# EAGLE design eagle_whitestar-adapter-ta (EAGLE 7.3.0)
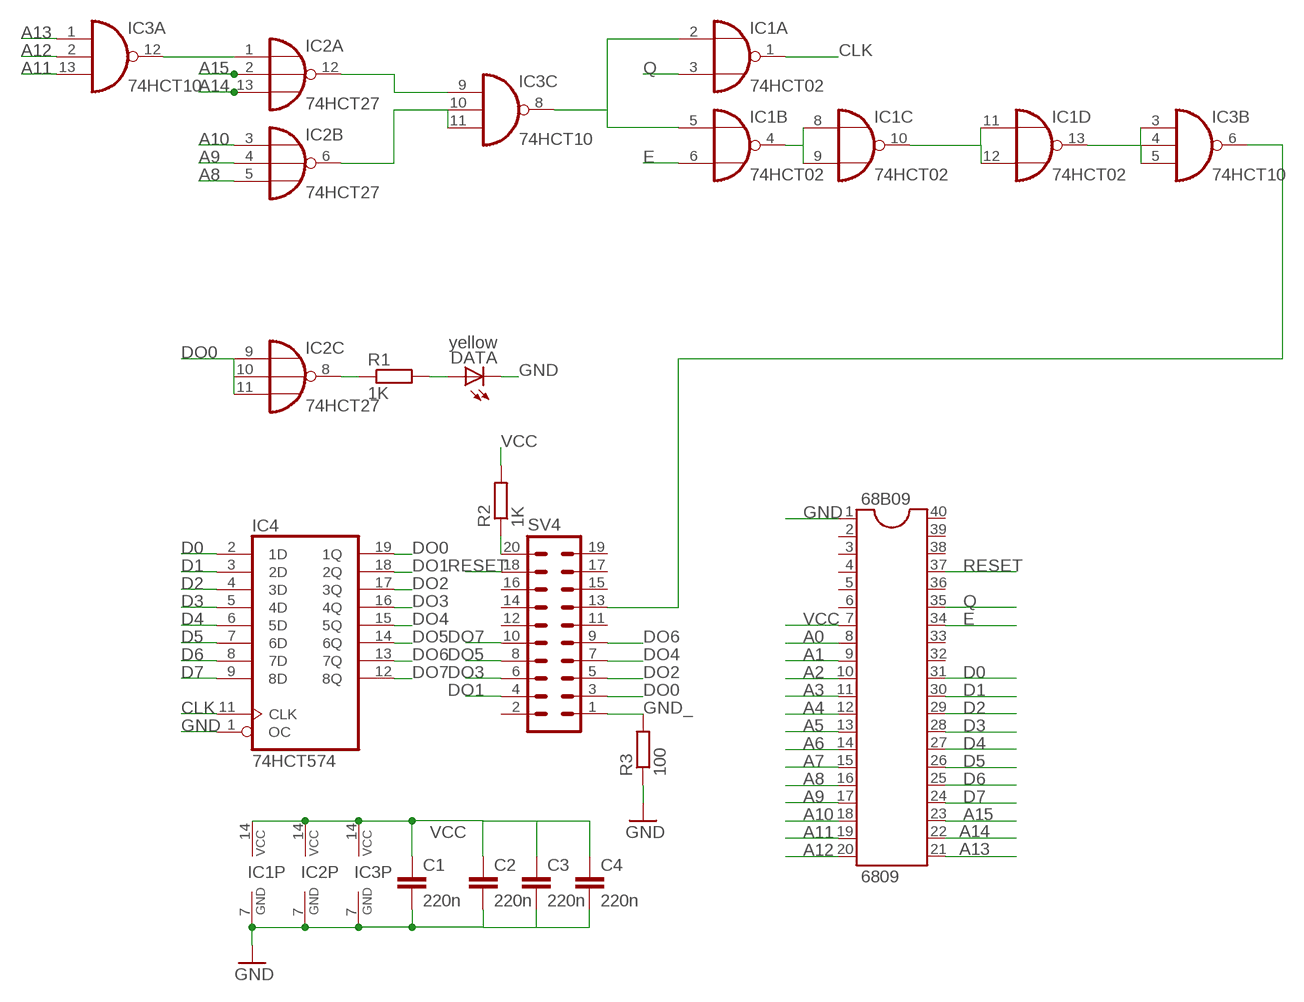
[diagram p0: schematic, sheet 1]

## Parts
68B09  6809  DIL40  [DIL40]
C1  220n  C-EUC0603K  [C0603K]
C2  220n  C-EUC0603K  [C0603K]
C3  220n  C-EUC0603K  [C0603K]
C4  220n  C-EUC0603K  [C0603K]
DATA  yellow  LEDSML0603  [SML0603]
IC1  74HCT02  74HCT02D  [SO14]
IC2  74HCT27  74HCT27D  [SO14]
IC3  74HCT10  74AC10D  [SO14]
IC4  74HCT574  74HCT574D  [SO20W]
R1  1K  R-EU_R0603  [R0603]
R2  1K  R-EU_R0603  [R0603]
R3  100  R-EU_R0603  [R0603]
SV4  MA10-2  [MA10-2]

## Nets
A0: 68B09.8
A1: 68B09.9
A2: 68B09.10
A3: 68B09.11
A4: 68B09.12
A5: 68B09.13
A6: 68B09.14
A7: 68B09.15
A8: 68B09.16 IC2.5(B:I2)
A9: 68B09.17 IC2.4(B:I1)
A10: 68B09.18 IC2.3(B:I0)
A11: 68B09.19 IC3.13(A:I2)
A12: 68B09.20 IC3.2(A:I1)
A13: 68B09.21 IC3.1(A:I0)
A14: 68B09.22 IC2.13(A:I2)
A15: 68B09.23 IC2.2(A:I1)
CLK: IC1.1(A:O) IC4.11(CLK)
D0: 68B09.31 IC4.2(1D)
D1: 68B09.30 IC4.3(2D)
D2: 68B09.29 IC4.4(3D)
D3: 68B09.28 IC4.5(4D)
D4: 68B09.27 IC4.6(5D)
D5: 68B09.26 IC4.7(6D)
D6: 68B09.25 IC4.8(7D)
D7: 68B09.24 IC4.9(8D)
DO0: IC2.9(C:I0) IC2.10(C:I1) IC2.11(C:I2) IC4.19(1Q) SV4.3
DO1: IC4.18(2Q) SV4.4
DO2: IC4.17(3Q) SV4.5
DO3: IC4.16(4Q) SV4.6
DO4: IC4.15(5Q) SV4.7
DO5: IC4.14(6Q) SV4.8
DO6: IC4.13(7Q) SV4.9
DO7: IC4.12(8Q) SV4.10
E: 68B09.34 IC1.6(B:I1)
GND: 68B09.1 C1.2 C2.2 C3.2 C4.2 DATA.C IC1.7(P:GND) IC2.7(P:GND) IC3.7(P:GND) IC4.1(OC) R3.1
GND_: R3.2 SV4.1
N$1: IC2.1(A:I0) IC3.12(A:O)
N$7: IC2.12(A:O) IC3.9(C:I0)
N$8: IC2.6(B:O) IC3.10(C:I1) IC3.11(C:I2)
N$9: IC1.2(A:I0) IC1.5(B:I0) IC3.8(C:O)
N$10: DATA.A R1.2
N$11: IC1.4(B:O) IC1.8(C:I0) IC1.9(C:I1)
N$12: IC1.10(C:O) IC1.11(D:I0) IC1.12(D:I1)
N$13: IC1.13(D:O) IC3.3(B:I0) IC3.4(B:I1) IC3.5(B:I2)
N$14: IC3.6(B:O) SV4.13
N$15: R2.1 SV4.20
N$16: IC2.8(C:O) R1.1
Q: 68B09.35 IC1.3(A:I1)
RESET: 68B09.37 SV4.18
VCC: 68B09.7 C1.1 C2.1 C3.1 C4.1 IC1.14(P:VCC) IC2.14(P:VCC) IC3.14(P:VCC) R2.2
Unconnected: 68B09.2 68B09.3 68B09.4 68B09.5 68B09.6 68B09.32 68B09.33 68B09.36 68B09.38 68B09.39 68B09.40 SV4.2 SV4.11 SV4.12 SV4.14 SV4.15 SV4.16 SV4.17 SV4.19

## Power pins joined to a net without a drawn wire
GND: IC4.10(GND)
VCC: IC4.20(VCC)

## Library data of the parts
68B09 = ic-package:DIL40: Dual In Line
C1-C4 = rcl:C-EU: CAPACITOR, European symbol
DATA = led:LED: LED OSRAM: - CHIPLED LG R971, LG N971, LY N971, LG Q971, LY Q971, LO R971, LY R971 LH N974, LH R974 LS Q976, LO Q976, LY Q976 LO Q996 - Hyper CHIPLED LW Q18S LB Q993, LB Q99A, LB R99A - SideLED LS A670, LO A670, LY A670, LG A670, LP A670 LB A673, LV A673, LT A673, LW A673 LH A674 LY A675 LS A676, LA A676, LO A676, LY A676, LW A676 LS A679, LY A679, LG A679 - Hyper Micro SIDELED® LS Y876, LA Y876, LO Y876, LY Y876 LT Y87S - SmartLED LW L88C, LW L88S LB L89C, LB L89S, LG L890 LS L89K, LO L89K, LY L89K LS L896, LA L896, LO L896, LY L896 - TOPLED LS T670, LO T670, LY T670, LG T670, LP T670 LSG T670, LSP T670, LSY T670, LOP T670, LYG T670 LG T671, LOG T671, LSG T671 LB T673, LV T673, LT T673, LW T673 LH T674 LS T676, LA T676, LO T676, LY T676, LB T676, LH T676, LSB T676, LW T676 LB T67C, LV T67C, LT T67C, LS T67K, LO T67K, LY T67K, LW E67C LS E67B, LA E67B, LO E67B, LY E67B, LB E67C, LV E67C, LT E67C LW T67C LS T679, LY T679, LG T679 LS T770, LO T770, LY T770, LG T770, LP T770 LB T773, LV T773, LT T773, LW T773 LH T774 LS E675, LA E675, LY E675, LS T675 LS T776, LA T776, LO T776, LY T776, LB T776 LHGB T686 LT T68C, LB T68C - Hyper Mini TOPLED® LB M676 - Mini TOPLED Santana® LG M470 LS M47K, LO M47K, LY M47K Source: http://www.osram.convergy.de LUXEON: - LUMILED® LXK2-PW12-R00, LXK2-PW12-S00, LXK2-PW14-U00, LXK2-PW14-V00 LXK2-PM12-R00, LXK2-PM12-S00, LXK2-PM14-U00 LXK2-PE12-Q00, LXK2-PE12-R00, LXK2-PE12-S00, LXK2-PE14-T00, LXK2-PE14-U00 LXK2-PB12-K00, LXK2-PB12-L00, LXK2-PB12-M00, LXK2-PB14-N00, LXK2-PB14-P00, LXK2-PB14-Q00 LXK2-PR12-L00, LXK2-PR12-M00, LXK2-PR14-Q00, LXK2-PR14-R00 LXK2-PD12-Q00, LXK2-PD12-R00, LXK2-PD12-S00 LXK2-PH12-R00, LXK2-PH12-S00 LXK2-PL12-P00, LXK2-PL12-Q00, LXK2-PL12-R00 Source: www.luxeon.com KINGBRIGHT: KA-3528ASYC Source: www.kingbright.com
IC1 = 74xx-eu:74*02: Quad 2-input NOR gate
IC2 = 74xx-eu:74*27: Triple 3-input NOR gate
IC3 = 74xx-eu:74*10: Triple 3-input NAND gate
IC4 = 74xx-eu:74*574: 8-bit D type FLIP FLOP bus driver
R1-R3 = rcl:R-EU_: RESISTOR, European symbol
SV4 = con-lstb:MA10-2: PIN HEADER; OC_FARNELL: unknown; OC_NEWARK: unknown

## Board
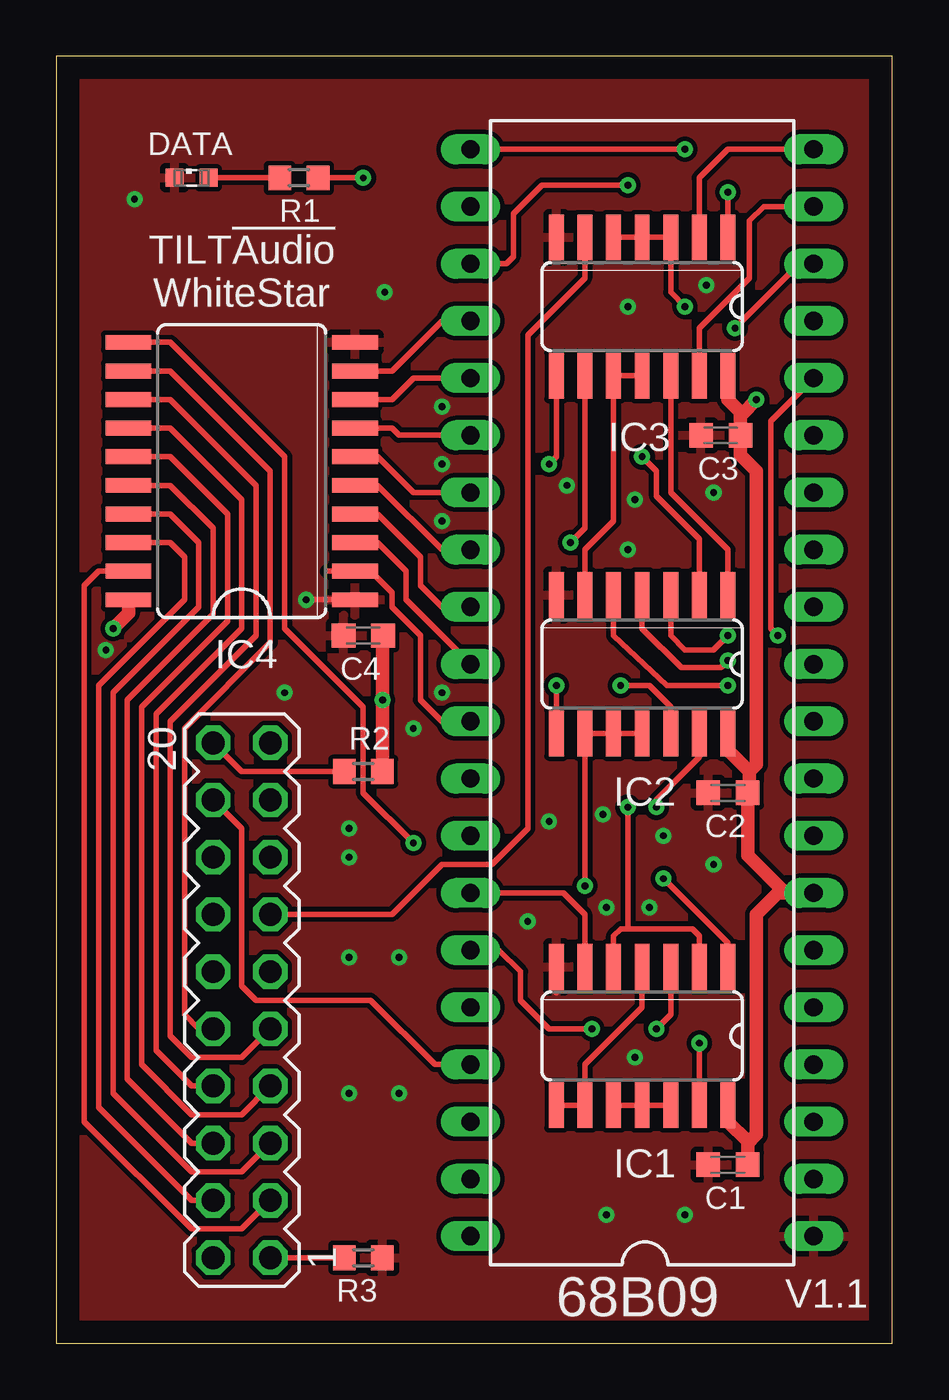
[diagram p1: board, top side]
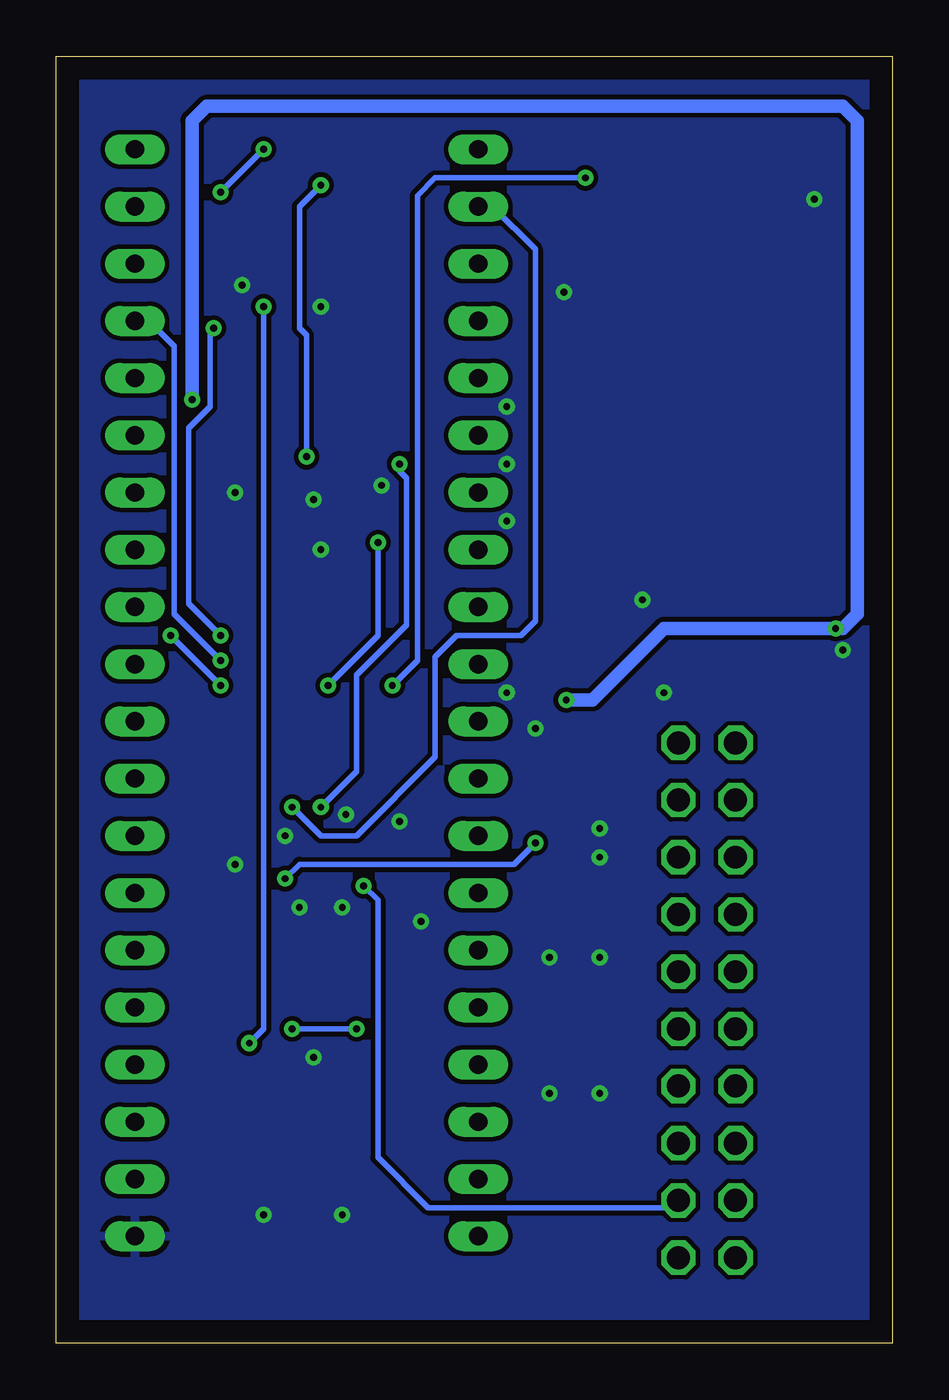
[diagram p2: board, bottom side, seen from below]

Size 37.13 x 57.14 mm. Coordinates in mm from the lower left corner, seen from the top.
Outline: 37.13,57.14 0,57.14 0,0 37.13,0 37.13,57.14
Copper layers (1*16): Top 0.035mm / dielectric 1.5mm / Bottom 0.035mm
Design rules "default *": minimum track width 6mil, minimum drill 12mil, track to track 8mil, track to pad 8mil, pad to pad 8mil, via to via 8mil, smd to smd 8mil, copper to edge 40mil, drill to drill 8mil, minimum pad ring 10mil, minimum via ring 8mil, stop-mask expansion 4mil, vias tented up to drill 0mil, thermal gap 10mil

### Footprints (pad centres in the part's own frame; a part is rotated, then mirrored left to right if it is on the bottom)
DIL40 = drill 0.813 long: 1 -24.13,-7.62; 2 -21.59,-7.62; 3 -19.05,-7.62; 4 -16.51,-7.62; 5 -13.97,-7.62; 6 -11.43,-7.62; 7 -8.89,-7.62; 8 -6.35,-7.62; 9 -3.81,-7.62; 10 -1.27,-7.62; 11 1.27,-7.62; 12 3.81,-7.62; 13 6.35,-7.62; 14 8.89,-7.62; 15 11.43,-7.62; 16 13.97,-7.62; 17 16.51,-7.62; 18 19.05,-7.62; 19 21.59,-7.62; 20 24.13,-7.62; 21 24.13,7.62; 22 21.59,7.62; 23 19.05,7.62; 24 16.51,7.62; 25 13.97,7.62; 26 11.43,7.62; 27 8.89,7.62; 28 6.35,7.62; 29 3.81,7.62; 30 1.27,7.62; 31 -1.27,7.62; 32 -3.81,7.62; 33 -6.35,7.62; 34 -8.89,7.62; 35 -11.43,7.62; 36 -13.97,7.62; 37 -16.51,7.62; 38 -19.05,7.62; 39 -21.59,7.62; 40 -24.13,7.62
C0603K = smd 1.05 x 1.08: 1 -0.875,0; 2 0.875,0
SML0603 = smd 0.8 x 0.8: A 0.75,0; C -0.75,0
SO14 = smd 0.66 x 2.032: 1 -3.81,-3.073; 2 -2.54,-3.073; 3 -1.27,-3.073; 4 0,-3.073; 5 1.27,-3.073; 6 2.54,-3.073; 7 3.81,-3.073; 8 3.81,3.073; 9 2.54,3.073; 10 1.27,3.073; 11 0,3.073; 12 -1.27,3.073; 13 -2.54,3.073; 14 -3.81,3.073
SO20W = smd 0.66 x 2.032: 1 -5.715,-5.029; 2 -4.445,-5.029; 3 -3.175,-5.029; 4 -1.905,-5.029; 5 -0.635,-5.029; 6 0.635,-5.029; 7 1.905,-5.029; 8 3.175,-5.029; 9 4.445,-5.029; 10 5.715,-5.029; 11 5.715,5.029; 12 4.445,5.029; 13 3.175,5.029; 14 1.905,5.029; 15 0.635,5.029; 16 -0.635,5.029; 17 -1.905,5.029; 18 -3.175,5.029; 19 -4.445,5.029; 20 -5.715,5.029
R0603 = smd 1 x 1.1: 1 -0.85,0; 2 0.85,0
MA10-2 = drill 1.016 octagon: 1 -11.43,-1.27; 2 -11.43,1.27; 3 -8.89,-1.27; 4 -8.89,1.27; 5 -6.35,-1.27; 6 -6.35,1.27; 7 -3.81,-1.27; 8 -3.81,1.27; 9 -1.27,-1.27; 10 -1.27,1.27; 11 1.27,-1.27; 12 1.27,1.27; 13 3.81,-1.27; 14 3.81,1.27; 15 6.35,-1.27; 16 6.35,1.27; 17 8.89,-1.27; 18 8.89,1.27; 19 11.43,-1.27; 20 11.43,1.27

### Placement (x,y rotation side)
68B09  26.02,28.88 90 top
C1  29.82,7.92 180 top
C2  29.82,24.44 180 top
C3  29.51,40.31 180 top
C4  13.63,31.42 180 top
DATA  6.01,51.74 0 top
IC1  26.02,13.64 180 top
IC2  26.02,30.15 180 top
IC3  26.02,46.02 180 top
IC4  8.24,38.72 90 top
R1  10.78,51.74 180 top
R2  13.63,25.39 0 top
R3  13.63,3.8 180 top
SV4  8.24,15.23 90 top

### Tracks (layer width: path | path; a pad name or v marks a point on that pad's centre or on a via)
A8  (via drill 0.3)
  Top 0.254: IC2.5 24.75,31.42 27.13,29.2 v29.82,29.2 | 68B09.16 31.73,40.95 31.73,31.74 v32.05,31.42
  Bottom 0.254: v29.82,29.2 v32.05,31.42
A9  (via drill 0.3)
  Top 0.254: IC2.4 26.02,31.74 27.76,29.99 29.51,29.99 v29.82,30.31
  Bottom 0.254: v29.82,30.31 31.89,32.37 31.89,44.28 33,45.39 68B09.17
A10  (via drill 0.3)
  Top 0.254: 68B09.18 33,47.93 v30.14,45.07 | IC2.3 27.29,31.42 27.92,30.78 29.19,30.78 v29.82,31.42
  Bottom 0.254: v29.82,31.42 31.25,32.85 31.25,40.63 30.3,41.58 30.3,44.75 v30.14,45.07
A11
  Top 0.254: 68B09.19 31.41,50.47 30.78,49.83 30.78,47.29 28.55,45.07 IC3.13
A12
  Top 0.254: 68B09.20 29.82,53.01 28.55,51.74 IC3.2
A13  (via drill 0.3)
  Top 0.254: v27.92,53.01 68B09.21 | IC3.1 v29.82,51.1
  Bottom 0.254: v29.82,51.1 v27.92,53.01
A14  (via drill 0.3)
  Top 0.254: IC2.13 28.55,26.02 26.65,24.12 v26.65,23.8
  Bottom 0.254: 68B09.22 17.76,50.47 15.86,48.57 15.86,32.06 16.49,31.42 19.35,31.42 20.3,30.47 20.3,26.02 23.79,22.53 25.38,22.53 v26.65,23.8
A15  (via drill 0.3)
  Top 0.254: IC2.2 28.55,35.71 26.65,37.61 26.65,38.72 v26.02,39.36 | v25.38,51.42 21.57,51.42 20.3,50.15 20.3,48.25 19.98,47.93 68B09.23
  Bottom 0.254: v26.02,39.36 26.02,44.75 26.33,45.07 26.33,50.47 v25.38,51.42
CLK  (via drill 0.3)
  Top 0.254: IC4.11 5.06,44.44 10.14,39.36 10.14,31.74 13.63,28.25 13.63,24.44 v15.86,22.21 | IC1.1 29.82,17.77 v26.97,20.62
  Bottom 0.254: v26.97,20.62 26.33,21.26 16.81,21.26 v15.86,22.21
D0
  Top 0.254: 12.04,34.28 IC4.2 13.95,34.28 14.9,33.32 14.9,32.69 16.17,31.42 16.17,28.56 17.12,27.61 68B09.31
D1
  Top 0.254: IC4.3 14.27,35.55 15.54,34.28 15.54,33.01 68B09.30
D2
  Top 0.254: IC4.4 14.27,36.82 16.17,34.91 16.17,33.64 17.12,32.69 68B09.29
D3
  Top 0.254: IC4.5 14.27,38.09 17.12,35.23 68B09.28
D4
  Top 0.254: 68B09.27 15.86,37.77 14.27,39.36 IC4.6
D5
  Top 0.254: 68B09.26 15.22,40.31 14.9,40.63 IC4.7
D6
  Top 0.254: 68B09.25 15.86,42.85 14.9,41.9 IC4.8
D7
  Top 0.254: 68B09.24 17.12,45.39 14.9,43.17 IC4.9
DO0  (via drill 0.3)
  Top 0.254: IC2.11 IC2.10 IC2.9 v23.48,20.31 | SV4.3 8.24,5.07 6.01,5.07 1.25,9.83 1.25,33.64 1.89,34.28 IC4.19
  Bottom 0.254: v23.48,20.31 22.84,19.67 22.84,8.24 20.62,6.02 9.82,6.02 SV4.3
DO1
  Top 0.254: SV4.4 6.01,6.34 1.89,10.46 1.89,29.2 5.7,33.01 5.7,34.91 5.06,35.55 IC4.18
DO2
  Top 0.254: SV4.5 8.24,7.61 6.01,7.61 2.52,11.1 2.52,28.88 6.33,32.69 6.33,35.55 5.06,36.82 IC4.17
DO3
  Top 0.254: SV4.6 6.01,8.88 3.15,11.74 3.15,28.56 6.97,32.37 6.97,36.18 5.06,38.09 IC4.16
DO4
  Top 0.254: SV4.7 8.24,10.15 6.01,10.15 3.79,12.37 3.79,28.25 7.6,32.06 7.6,36.82 5.06,39.36 IC4.15
DO5
  Top 0.254: SV4.8 6.01,11.42 4.43,13.01 4.43,27.93 8.24,31.74 8.24,37.45 5.06,40.63 IC4.14
DO6
  Top 0.254: SV4.9 8.24,12.69 6.01,12.69 5.06,13.64 5.06,27.61 8.87,31.42 8.87,38.09 5.06,41.9 IC4.13
DO7
  Top 0.254: SV4.10 6.33,13.96 5.7,14.59 5.7,27.29 9.51,31.1 9.51,38.72 5.06,43.17 IC4.12
E
  Top 0.254: 68B09.34 22.52,19.99 23.48,19.04 IC1.6
GND  (via drill 0.3)
  Top 0.254: 22.21,15.54 IC1.7 | IC4.1 v11.09,33.01
  other vias: 29.19,21.26 29.19,37.77 22.68,38.09 25.38,35.23 25.7,37.45 13,21.58 13,22.85 21.89,23.16 26.97,22.53 26.33,19.36 20.93,18.72 24.27,23.48 24.43,19.36 25.7,12.69 15.86,27.29 10.14,28.88 17.12,36.5 17.12,39.04 17.12,41.58 17.12,28.88 2.2,30.79 25.38,46.02 28.87,46.98 13,17.13 15.22,17.13 13,11.1 15.22,11.1 24.43,5.7 27.92,5.7 14.59,46.66 3.47,50.79
  pour Bottom: 37.13,-0.01 -0.02,-0.01 -0.02,57.14 37.13,57.14
  pour Top: 37.13,-0.01 -0.02,-0.01 -0.02,57.14 37.13,57.14
GND_
  Top 0.254: R3.2 SV4.1
N$1
  Top 0.254: IC2.1 29.82,35.23 27.29,37.77 IC3.12
N$7  (via drill 0.3)
  Top 0.254: IC3.9 23.48,36.18 v22.84,35.55 | v25.06,29.2 26.33,29.2 27.29,28.25 IC2.12
  Bottom 0.254: v22.84,35.55 22.84,31.42 v25.06,29.2
N$8
  Top 0.254: IC2.6 23.48,35.23 24.75,36.5 IC3.10 IC3.11
N$9  (via drill 0.3)
  Top 0.254: IC3.8 22.21,39.36 v21.89,39.04 | IC1.2 28.55,18.09 28.24,18.4 25.38,18.4 | v25.38,23.8 25.38,18.4 | IC1.5 24.75,18.09 25.06,18.4 25.38,18.4
  Bottom 0.254: v21.89,39.04 21.89,38.72 21.57,38.4 21.57,31.9 23.79,29.67 23.79,25.39 v25.38,23.8
N$10
  Top 0.254: R1.2 DATA.A
N$11
  Top 0.254: IC1.8 IC1.9 23.48,12.37 26.02,14.91 IC1.4
N$12
  Top 0.254: IC1.12 IC1.11 IC1.10
N$13  (via drill 0.3)
  Top 0.254: IC3.5 IC3.4 IC3.3 27.29,46.66 v27.92,46.03 | v28.55,13.32 IC1.13
  Bottom 0.254: v27.92,46.03 27.92,13.96 v28.55,13.32
N$14
  Top 0.254: IC3.6 23.48,47.29 20.93,44.75 20.93,22.85 19.35,21.26 17.12,21.26 14.9,19.04 SV4.13
N$15
  Top 0.254: SV4.20 8.24,25.39 R2.1
N$16  (via drill 0.3)
  Top 0.254: v13.63,51.74 R1.1 | IC2.8 v22.21,29.2
  Bottom 0.254: v22.21,29.2 21.09,30.31 21.09,50.95 20.3,51.74 v13.63,51.74
Q  (via drill 0.3, 0.31)
  Top 0.254: IC1.3 27.29,14.59 v26.65,13.96 | v23.79,13.96 21.89,13.96 20.62,15.23 20.62,16.5 19.66,17.45 68B09.35
  Bottom 0.254: v26.65,13.96 v23.79,13.96
RESET
  Top 0.254: SV4.18 8.24,22.85 8.24,15.86 8.87,15.23 13.95,15.23 16.81,12.37 68B09.37
VCC  (via drill 0.3)
  Top 0.61: IC1.14 29.82,9.83 30.7,8.95 30.7,8.88 | C1.1 30.7,8.88 | 68B09.7 32.36,19.99 | 32.36,19.99 32.05,19.99 31.09,19.04 31.09,9.27 30.7,8.88 | IC2.14 29.82,26.34 30.78,25.39 | 30.78,25.39 30.78,24.51 C2.1 30.7,21.66 32.36,19.99 | IC3.14 29.82,41.9 30.38,41.34 30.38,41.26 | 30.38,41.26 C3.1 30.38,39.43 31.09,38.72 31.09,25.71 30.78,25.39 | C4.1 14.48,31.39 v14.48,28.56 R2.2 | IC4.20 3.21,32.42 v2.52,31.74 | v31.09,41.9 30.46,41.26 30.38,41.26
  Bottom 0.61: v14.48,28.56 13.32,28.56 10.14,31.74 v2.52,31.74 2.2,31.74 1.57,32.37 1.57,54.28 2.2,54.92 30.46,54.92 31.09,54.28 v31.09,41.9

### Text on the board
tNames: TILT!Audio / WhiteStar | V1.1